# EAGLE board BusPirate-LCD.v0a (EAGLE 8.4.3)
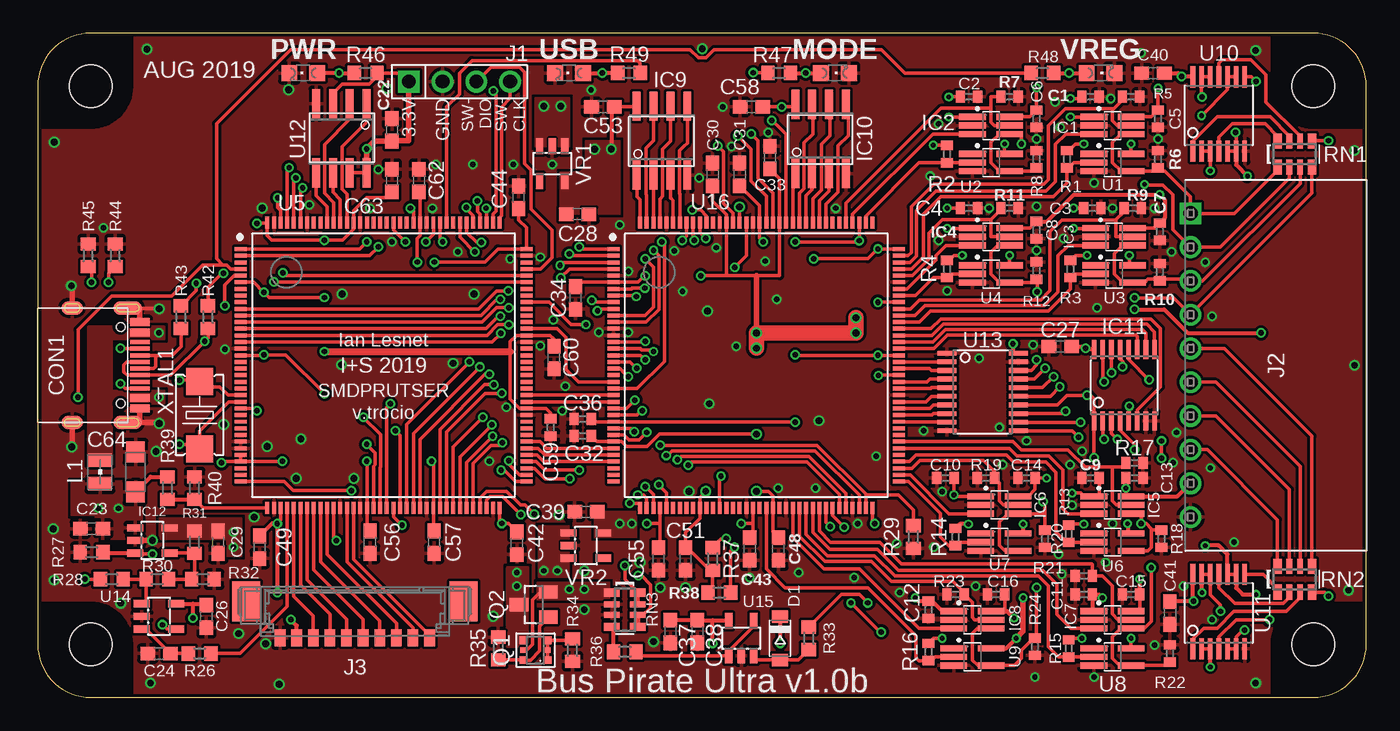
[diagram p2: board, top side]
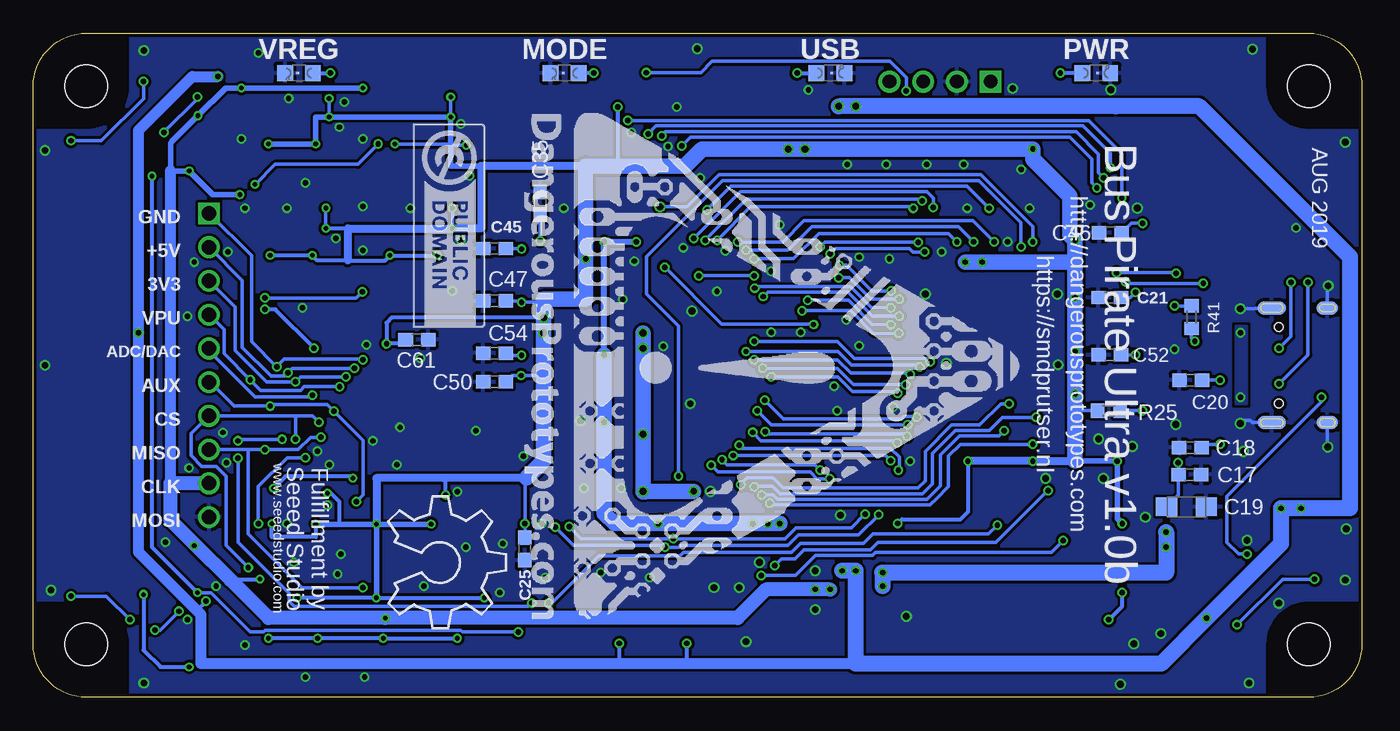
[diagram p3: board, bottom side, seen from below]

Size 100 x 50 mm. Coordinates in mm from the lower left corner, seen from the top.
Copper layers (1*16): Top 0.035mm / dielectric 1.5mm / Bottom 0.035mm
Design rules "dirt_cheap_dirty_boards.v1.1": minimum track width 6mil, minimum drill 12mil, track to track 6mil, track to pad 6mil, pad to pad 6mil, via to via 6mil, smd to smd 0mil, copper to edge 10mil, drill to drill 10mil, minimum pad ring 10mil, minimum via ring 6mil, stop-mask expansion 2mil, vias tented up to drill 25mil, thermal gap 10mil

## Footprints (pad centres in the part's own frame; a part is rotated, then mirrored left to right if it is on the bottom)
C0402 = smd 0.7 x 0.9: 1 -0.65,0; 2 0.65,0
C0603 = smd 1.1 x 1: 1 -0.85,0; 2 0.85,0
SMC_A = smd 1.6 x 1.4: + -1.5,0; - 1.5,0
C603 = smd 1.1 x 1: 1 -0.85,0; 2 0.85,0
C402 = smd 0.7 x 0.9: 1 -0.65,0; 2 0.65,0
C-31-M-12 = smd 0.3 x 1.45: CC1 -1.25,3.005; CC2 1.75,3.005; DN1 0.25,3.005; DN2 -0.75,3.005; DP1 -0.25,3.005; DP2 0.75,3.005; SBU1 1.25,3.005; SBU2 -1.75,3.005 | smd 0.6 x 1.45: GND@1 -3.25,3.005; GND@2 3.25,3.005; VBUS@1 -2.45,3.005; VBUS@2 2.45,3.005 | smd 1 x 2.1: P$1 4.32,2.09; P$2 -4.32,2.09 | smd 1 x 1.6: P$3 -4.32,-2.09; P$4 4.32,-2.09 | smd 1 x 2.1 bottom: P$5 -4.32,2.09; P$8 4.32,2.09 | smd 1 x 1.6 bottom: P$6 -4.32,-2.09; P$7 4.32,-2.09 | hole 0.65: 2.89,1.56; -2.89,1.56
SOD-123 = smd 0.91 x 1.22: A 1.635,0; C -1.635,0
SC-70-6_EXTENDED_PADS = smd 0.47 x 2: 1 -0.65,-1.4; 2 0,-1.4; 3 0.65,-1.4; 4 0.65,1.4; 5 0,1.4; 6 -0.65,1.4
SOIC-8 = smd 0.6 x 2.2: 1 -1.905,-2.6; 2 -0.635,-2.6; 3 0.635,-2.6; 4 1.905,-2.6; 5 1.905,2.6; 6 0.635,2.6; 7 -0.635,2.6; 8 -1.905,2.6
TSSOP-16 = smd 0.35 x 1.43: 1 -2.275,-2.7; 2 -1.625,-2.7; 3 -0.975,-2.7; 4 -0.325,-2.7; 5 0.325,-2.7; 6 0.975,-2.7; 7 1.625,-2.7; 8 2.275,-2.7; 9 2.275,2.7; 10 1.625,2.7; 11 0.975,2.7; 12 0.325,2.7; 13 -0.325,2.7; 14 -0.975,2.7; 15 -1.625,2.7; 16 -2.275,2.7
SOT-23-5 = smd 0.55 x 1.2: 1 -0.95,-1.3; 2 0,-1.3; 3 0.95,-1.3; 4 0.95,1.3; 5 -0.95,1.3
M1X4 = drill 1.02 pad 1.632 square: 1 0,0 | drill 1.02 pad 1.632: 2 2.54,0; 3 5.08,0; 4 7.62,0
M1X10_MALE_RIGHT_ANGLES_PTH_SHROUDED = drill 1.09 square: 1 -11.43,-6.415 | drill 1.09: 2 -8.89,-6.415; 3 -6.35,-6.415; 4 -3.81,-6.415; 5 -1.27,-6.415; 6 1.27,-6.415; 7 3.81,-6.415; 8 6.35,-6.415; 9 8.89,-6.415; 10 11.43,-6.415
MOLEX_533980771 = smd 2.1 x 3: B1 -8.175,1.513; B2 8.175,1.513 | smd 0.8 x 1.3: P1 5.625,-1.238; P2 4.375,-1.238; P3 3.125,-1.238; P4 1.875,-1.238; P5 0.625,-1.238; P6 -0.625,-1.238; P7 -1.875,-1.238; P8 -3.125,-1.238; P9 -4.375,-1.238; P10 -5.625,-1.238
WE-KI_0805_B = smd 1.02 x 1.78: 1 -0.89,0; 2 0.89,0
LED-805 = smd 1.2 x 1.2: A 0,-1.05; C 0,1.05
DP10050_V1 = hole 3.2: 4,4; 96,4; 96,46; 4,46
SOT-363 = smd 0.6 x 0.6: 1 -0.75,-0.9; 3 0.75,-0.9; 4 0.75,0.9; 6 -0.75,0.9 | smd 0.4 x 0.5: 2 0,-0.9; 5 0,0.9
SOT-23 = smd 1 x 1.4: 1 -0.95,-1.1; 2 0.95,-1.1; 3 0,1.1
R0402 = smd 0.7 x 0.9: 1 -0.65,0; 2 0.65,0
R603 = smd 1 x 1.1: 1 -0.85,0; 2 0.85,0
R0603 = smd 1 x 1.1: 1 -0.85,0; 2 0.85,0
RN8P-4R-CRA06S = smd 0.63 x 1.15: 1 -1.295,-0.975; 4 1.295,-0.975; 5 1.295,0.975; 8 -1.295,0.975 | smd 0.44 x 1.15: 2 -0.4,-0.975; 3 0.4,-0.975; 6 0.4,0.975; 7 -0.4,0.975
SC-70-5_EXTENDED_PADS = smd 0.47 x 2: 1 -0.65,-1.4; 2 0,-1.4; 3 0.65,-1.4; 4 0.65,1.4; 5 -0.65,1.4
TQFP-144 = smd 0.9 x 0.3: 1 -10.75,8.75; 2 -10.75,8.25; 3 -10.75,7.75; 4 -10.75,7.25; 5 -10.75,6.75; 6 -10.75,6.25; 7 -10.75,5.75; 8 -10.75,5.25; 9 -10.75,4.75; 10 -10.75,4.25; 11 -10.75,3.75; 12 -10.75,3.25; 13 -10.75,2.75; 14 -10.75,2.25; 15 -10.75,1.75; 16 -10.75,1.25; 17 -10.75,0.75; 18 -10.75,0.25; 19 -10.75,-0.25; 20 -10.75,-0.75; 21 -10.75,-1.25; 22 -10.75,-1.75; 23 -10.75,-2.25; 24 -10.75,-2.75; 25 -10.75,-3.25; 26 -10.75,-3.75; 27 -10.75,-4.25; 28 -10.75,-4.75; 29 -10.75,-5.25; 30 -10.75,-5.75; 31 -10.75,-6.25; 32 -10.75,-6.75; 33 -10.75,-7.25; 34 -10.75,-7.75; 35 -10.75,-8.25; 36 -10.75,-8.75; 73 10.75,-8.75; 74 10.75,-8.25; 75 10.75,-7.75; 76 10.75,-7.25; 77 10.75,-6.75; 78 10.75,-6.25; 79 10.75,-5.75; 80 10.75,-5.25; 81 10.75,-4.75; 82 10.75,-4.25; 83 10.75,-3.75; 84 10.75,-3.25; 85 10.75,-2.75; 86 10.75,-2.25; 87 10.75,-1.75; 88 10.75,-1.25; 89 10.75,-0.75; 90 10.75,-0.25; 91 10.75,0.25; 92 10.75,0.75; 93 10.75,1.25; 94 10.75,1.75; 95 10.75,2.25; 96 10.75,2.75; 97 10.75,3.25; 98 10.75,3.75; 99 10.75,4.25; 100 10.75,4.75; 101 10.75,5.25; 102 10.75,5.75; 103 10.75,6.25; 104 10.75,6.75; 105 10.75,7.25; 106 10.75,7.75; 107 10.75,8.25; 108 10.75,8.75 | smd 0.3 x 0.9: 37 -8.75,-10.75; 38 -8.25,-10.75; 39 -7.75,-10.75; 40 -7.25,-10.75; 41 -6.75,-10.75; 42 -6.25,-10.75; 43 -5.75,-10.75; 44 -5.25,-10.75; 45 -4.75,-10.75; 46 -4.25,-10.75; 47 -3.75,-10.75; 48 -3.25,-10.75; 49 -2.75,-10.75; 50 -2.25,-10.75; 51 -1.75,-10.75; 52 -1.25,-10.75; 53 -0.75,-10.75; 54 -0.25,-10.75; 55 0.25,-10.75; 56 0.75,-10.75; 57 1.25,-10.75; 58 1.75,-10.75; 59 2.25,-10.75; 60 2.75,-10.75; 61 3.25,-10.75; 62 3.75,-10.75; 63 4.25,-10.75; 64 4.75,-10.75; 65 5.25,-10.75; 66 5.75,-10.75; 67 6.25,-10.75; 68 6.75,-10.75; 69 7.25,-10.75; 70 7.75,-10.75; 71 8.25,-10.75; 72 8.75,-10.75; 109 8.75,10.75; 110 8.25,10.75; 111 7.75,10.75; 112 7.25,10.75; 113 6.75,10.75; 114 6.25,10.75; 115 5.75,10.75; 116 5.25,10.75; 117 4.75,10.75; 118 4.25,10.75; 119 3.75,10.75; 120 3.25,10.75; 121 2.75,10.75; 122 2.25,10.75; 123 1.75,10.75; 124 1.25,10.75; 125 0.75,10.75; 126 0.25,10.75; 127 -0.25,10.75; 128 -0.75,10.75; 129 -1.25,10.75; 130 -1.75,10.75; 131 -2.25,10.75; 132 -2.75,10.75; 133 -3.25,10.75; 134 -3.75,10.75; 135 -4.25,10.75; 136 -4.75,10.75; 137 -5.25,10.75; 138 -5.75,10.75; 139 -6.25,10.75; 140 -6.75,10.75; 141 -7.25,10.75; 142 -7.75,10.75; 143 -8.25,10.75; 144 -8.75,10.75
TSSOP-14 = smd 0.35 x 1.6: 1 -1.95,-2.7; 2 -1.3,-2.7; 3 -0.65,-2.7; 4 0,-2.7; 5 0.65,-2.7; 6 1.3,-2.7; 7 1.95,-2.7; 8 1.95,2.9; 9 1.3,2.9; 10 0.65,2.9; 11 0,2.9; 12 -0.65,2.9; 13 -1.3,2.9; 14 -1.95,2.9
TSSOP-20 = smd 0.35 x 1.43: 1 -2.925,-2.7; 2 -2.275,-2.7; 3 -1.625,-2.7; 4 -0.975,-2.7; 5 -0.325,-2.7; 6 0.325,-2.7; 7 0.975,-2.7; 8 1.625,-2.7; 9 2.275,-2.7; 10 2.925,-2.7; 11 2.925,2.7; 12 2.275,2.7; 13 1.625,2.7; 14 0.975,2.7; 15 0.325,2.7; 16 -0.325,2.7; 17 -0.975,2.7; 18 -1.625,2.7; 19 -2.275,2.7; 20 -2.925,2.7
SOT-23-5@1 = smd 0.55 x 1.2: 1 -0.95,-1.3; 2 0,-1.3; 3 0.95,-1.3; 4 0.95,1.3; 5 -0.95,1.3
XTAL_4X6 = smd 2.032 x 2.032: 1 -2.54,0; 2 2.54,0

## Placement (x,y rotation side)
C1  0.1uF  [C0402]  79.25,45.21 0 top
C2  0.1uF  [C0402]  70.1,45.21 0 top
C3  0.1uF  [C0402]  79.38,36.83 0 top
C4  0.1uF  [C0402]  70.1,36.83 0 top
C5  0.1uF  [C0402]  84.33,43.56 90 top
C6  0.1uF  [C0402]  75.18,43.56 90 top
C7  0.1uF  [C0402]  84.45,35.05 90 top
C8  0.1uF  [C0402]  75.18,35.18 90 top
C9  0.1uF  [C0402]  79.25,16.51 180 top
C10  0.1uF  [C0402]  68.33,16.51 180 top
C11  0.1uF  [C0402]  78.74,7.75 180 top
C12  0.1uF  [C0402]  67.06,6.6 270 top
C13  0.1uF  [C0402]  82.55,16.51 180 top
C14  0.1uF  [C0402]  74.42,16.51 0 top
C15  0.1uF  [C0402]  82.3,7.75 0 top
C16  0.1uF  [C0402]  72.14,7.75 0 top
C17  0.1uF  [C0603]  12.95,16.76 180 bottom
C18  22pF  [C0603]  12.91,18.8 0 bottom
C19  1uF  [SMC_A]  13.21,14.35 0 bottom
C20  22pF  [C0603]  12.88,23.88 0 bottom
C21  0.1uF  [C0603]  18.97,30.1 0 bottom
C22  0.1uF  [C0603]  26.67,42.72 270 top
C23  10uF  [C603]  4.06,12.7 180 top
C24  [C0603]  9.14,3.3 180 top
C25  0.1uF  [C0603]  62.99,11.18 90 bottom
C26  0.1uF  [C0603]  12.7,6.1 270 top
C27  0.1uF  [C0603]  76.96,26.42 180 top
C28  1uf  [C0603]  40.64,36.37 0 top
C29  1uF  [C603]  13.59,11.68 270 top
C30  0.1uF  [C0603]  50.8,39.37 270 top
C31  0.1uF  [C0603]  52.83,39.37 270 top
C32  0.1uF  [C402]  41.02,19.68 180 top
C33  0.1uF  [C0603]  55.12,40.64 270 top
C34  0.1uF  [C0603]  40.49,30.07 90 top
C35  0.1uF  [C0603]  61.85,37.21 270 bottom
C36  0.1uF  [C402]  41.02,20.95 180 top
C37  0.1uF  [C0603]  47.62,4.95 270 top
C38  1uF  [C0603]  49.66,4.95 270 top
C39  1uf  [C0603]  41.27,13.97 180 top
C40  0.1uF  [C0603]  83.95,46.99 180 top
C41  0.1uF  [C0603]  85.22,6.35 270 top
C42  0.1uF  [C0603]  36.07,11.61 90 top
C43  0.1uF  [C0603]  53.59,11.18 90 top
C44  0.1uF  [C0603]  36.2,37.64 270 top
C45  0.1uF  [C0603]  65.28,33.78 0 bottom
C46  0.1uF  [C0603]  18.92,34.97 0 bottom
C47  0.1uF  [C0603]  65.28,29.84 0 bottom
C48  0.1uF  [C0603]  55.75,11.18 90 top
C49  0.1uF  [C0603]  16.72,11.3 90 top
C50  0.1uF  [C0603]  65.28,23.75 0 bottom
C51  0.1uF  [C0603]  48.77,10.41 90 top
C52  0.1uF  [C0603]  18.97,25.78 0 bottom
C53  0.1uF  [C0603]  42.55,44.45 180 top
C54  0.1uF  [C0603]  65.28,25.91 0 bottom
C55  0.1uF  [C0603]  46.74,10.41 90 top
C56  0.1uF  [C0603]  25.02,11.68 90 top
C57  0.1uF  [C0603]  29.84,11.68 90 top
C58  0.1uF  [C0603]  53.72,44.45 180 top
C59  0.1uF  [C402]  38.61,20.32 270 top
C60  0.1uF  [C0603]  38.86,25.57 90 top
C61  0.1uF  [C0603]  71.12,26.92 0 bottom
C62  0.1uF  [C0603]  28.7,38.91 270 top
C63  0.1uF  [C0603]  26.67,38.91 270 top
C64  10uF  [SMC_A]  7.37,16.97 90 top
CON1  USB-C-12  [C-31-M-12]  4.69,25 270 top
D1  [SOD-123]  55.88,4.45 270 top
IC1  SN74LVC1T45DBV  [SC-70-6_EXTENDED_PADS]  80.9,43.05 270 top
IC2  SN74LVC1T45DBV  [SC-70-6_EXTENDED_PADS]  71.75,43.05 270 top
IC3  SN74LVC1T45DBV  [SC-70-6_EXTENDED_PADS]  81.03,34.67 270 top
IC4  SN74LVC1T45DBV  [SC-70-6_EXTENDED_PADS]  71.75,34.67 270 top
IC5  SN74LVC1T45DBV  [SC-70-6_EXTENDED_PADS]  80.9,14.48 270 top
IC6  SN74LVC1T45DBV  [SC-70-6_EXTENDED_PADS]  72.39,14.48 270 top
IC7  SN74LVC1T45DBV  [SC-70-6_EXTENDED_PADS]  80.9,5.84 270 top
IC8  SN74LVC1T45DBV  [SC-70-6_EXTENDED_PADS]  70.36,5.84 270 top
IC9  23LC1024  [SOIC-8]  46.99,41.91 0 top
IC10  23LC1024  [SOIC-8]  58.93,42.04 0 top
IC11  74HCT4051  [TSSOP-16]  81.79,23.5 0 top
IC12  MCP1824_ADJ  [SOT-23-5]  8.64,11.81 270 top
J1  CON_HEADER_1X04  [M1X4]  27.94,46.35 0 top
J2  CON_HEADER_1X10-RIGHT_ANGLED_PTH_SHROUDED  [M1X10_MALE_RIGHT_ANGLES_PTH_SHROUDED]  93.19,25 270 top
J3  CON_MOLEX_MALE_SMT_SH_1.25  [MOLEX_533980771]  23.88,5.71 0 top
L1  1.5A  [WE-KI_0805_B]  4.7,16.97 90 top
LED1  Optional YELLOW  [LED-805]  20,47 270 bottom
LED2  YELLOW  [LED-805]  20,47 90 top
LED3  YELLOW  [LED-805]  60,47 270 top
LED4  Optional YELLOW  [LED-805]  60,47 90 bottom
LED5  YELLOW  [LED-805]  80,47 270 top
LED6  Optional YELLOW  [LED-805]  80,47 90 bottom
LED7  YELLOW  [LED-805]  40,47 90 top
LED8  Optional YELLOW  [LED-805]  40,47 270 bottom
LOGO1  LOGO_CC-0  [LOGO_CC-0]  71.37,43.18 270 bottom
PCB1  PCB_DP_RECTANGLE-50X100  [DP10050_V1]  0,0 0 top
Q1  DMMT3906W  [SOT-363]  37.47,3.56 90 top
Q2  [SOT-23]  37.34,6.99 90 top
R1  100K  [R0402]  77.47,40.51 90 top
R2  100K  [R0402]  68.45,40.89 90 top
R3  100K  [R0402]  77.72,32.26 90 top
R4  100K  [R0402]  68.45,32.26 90 top
R5  100K  [R0402]  82.3,45.21 180 top
R6  1M  [R0402]  84.33,40.51 270 top
R7  100K  [R0402]  73.15,45.21 180 top
R8  1M  [R0402]  75.18,40.51 270 top
R9  100K  [R0402]  82.42,36.83 180 top
R10  1M  [R0402]  84.45,32 270 top
R11  100K  [R0402]  73.15,36.83 180 top
R12  1M  [R0402]  75.18,32.13 270 top
R13  100K  [R0402]  77.6,12.32 90 top
R14  100K  [R0402]  69.09,12.06 90 top
R15  100K  [R0402]  77.6,3.68 90 top
R16  100K  [R0402]  67.06,3.41 90 top
R17  100K  [R0402]  82.55,17.65 180 top
R18  1M  [R0402]  84.58,11.94 90 top
R19  100K  [R0402]  71.37,16.51 0 top
R20  1M  [R0402]  75.82,11.94 90 top
R21  100K  [R0402]  78.74,9.14 0 top
R22  1M  [R0402]  85.22,3.3 270 top
R23  100K  [R0402]  69.09,7.75 0 top
R24  1M  [R0402]  75.06,3.81 90 top
R25  10K  [R603]  19.05,21.59 180 bottom
R26  [R0603]  12.19,3.3 180 top
R27  10K  [R603]  4.06,10.92 180 top
R28  0R  [R603]  5.59,8.89 0 top
R29  10K  [R0603]  65.91,12.06 90 top
R30  78.7K  [R603]  9.02,8.89 0 top
R31  100K  [R603]  11.81,11.68 90 top
R32  50K  [R603]  12.45,8.89 0 top
R33  [R0603]  58.04,4.45 270 top
R34  [R603]  40.26,3.56 90 top
R35  [R603]  34.67,3.68 270 top
R36  [R0603]  44.2,3.43 180 top
R37  10K  [R0603]  50.8,10.41 270 top
R38  10K  [R0603]  51.31,7.87 180 top
R39  10K  [R0603]  9.78,15.75 270 top
R40  10K  [R0603]  11.81,15.75 270 top
R41  1.5K  [R0603]  12.83,28.62 90 bottom
R42  22R  [R0603]  12.83,28.62 270 top
R43  22R  [R0603]  10.79,28.62 270 top
R44  5K1  [R0603]  5.84,33.27 90 top
R45  5K1  [R0603]  3.81,33.27 90 top
R46  1K1  [R603]  24.7,47 0 top
R47  1K1  [R603]  55.81,47 180 top
R48  1K1  [R603]  75.62,47 180 top
R49  1K1  [R603]  44.51,47 0 top
RN1  2K  [RN8P-4R-CRA06S]  94.61,40.89 0 top
RN2  2K  [RN8P-4R-CRA06S]  94.61,8.89 0 top
RN3  10K  [RN8P-4R-CRA06S]  44.2,6.6 270 top
U1  74LVC1G07DBV  [SC-70-5_EXTENDED_PADS]  80.9,40.26 270 top
U2  74LVC1G07DBV  [SC-70-5_EXTENDED_PADS]  71.75,40.26 270 top
U3  74LVC1G07DBV  [SC-70-5_EXTENDED_PADS]  81.03,31.88 270 top
U4  74LVC1G07DBV  [SC-70-5_EXTENDED_PADS]  71.75,31.88 270 top
U5  STM32F103ZX  [TQFP-144]  26.04,25 0 top
U6  74LVC1G07DBV  [SC-70-5_EXTENDED_PADS]  80.9,11.68 270 top
U7  74LVC1G07DBV  [SC-70-5_EXTENDED_PADS]  72.39,11.68 270 top
U8  74LVC1G07DBV  [SC-70-5_EXTENDED_PADS]  80.9,3.05 270 top
U9  74LVC1G07DBV  [SC-70-5_EXTENDED_PADS]  70.36,3.05 270 top
U10  74HCT4066PW  [TSSOP-14]  88.9,43.81 0 top
U11  74HCT4066PW  [TSSOP-14]  88.9,6.35 0 top
U12  W25X40CL  [SOIC-8]  22.86,42.09 180 top
U13  74LVC245A  [TSSOP-20]  71.12,22.99 270 top
U14  MCP6001  [SOT-23-5]  9.14,6.1 270 top
U15  MCP6001  [SOT-23-5]  52.96,4.45 0 top
U16  ICE40HX4K  [TQFP-144]  54.09,25 0 top
U$1  [DP-LOGO]  61.84,-11.22 0 top  (outside the outline)
U$2  [OSHW_8X350_NOTEXT]  73.28,15.11 270 bottom
U$4  [DP_LOGO_ART_1.5X1.5]  63.01,43.98 270 bottom
VR1  MCP1801T-3302I/OT  [SOT-23-5@1]  38.73,40.18 180 top
VR2  MCP1801T-1202I/OT  [SOT-23-5@1]  41.27,11.43 270 top
XTAL1  8Mhz  [XTAL_4X6]  12.19,21.26 90 top

## Tracks (layer width: path | path; a pad name or v marks a point on that pad's centre or on a via)
1V2  (via drill 0.41)
  Top 0.254: C55.2 46.84,11.37 U16.40 46.84,13.08 v45.85,13.08 | 53.84,13.08 53.84,12.27 C43.2 | C31.2 54.34,37.01 U16.126 54.34,34.56 v54.61,34.29 | C36.1 41.67,20.75 U16.27 45.26,20.75 56.97,20.75 v57.02,20.7 | 53.84,13.08 v52.96,13.08 | U16.54 53.84,13.08 | v57.02,25.78 57.05,25.75 v63.25,25.75 U16.92 | v57.02,34.29 61.75,34.29 v61.85,34.38 61.84,34.4 U16.111
  Bottom 0.254: C35.2 v61.85,34.38 | C54.2 64.27,25.75 v63.25,25.75
  Bottom 0.457: v57.02,25.78 v57.02,34.29 v54.61,34.29
  Bottom 1.168: v43.81,13.08 v45.85,13.08 46.86,13.08 48.26,13.08 v52.96,13.08 56.26,13.08 57.02,13.84 57.02,17.27 v57.02,20.7 v57.02,25.78
  other vias: 44.7,13.08
  pour Top (no thermals): 45.09,13.97 41.91,13.97 41.91,12.06 45.09,12.06
3V3  (via drill 0.35, 0.41, 0.51)
  Top 0.254: C62.2 28.79,37.98 U5.121 28.79,34.76 28.57,34.55 v28.57,32.77 | C60.2 38.86,26.97 38.58,27.25 U5.95 36.04,27.25 35.56,26.77 35.56,26.04 35.56,22.48 36.29,21.75 U5.84 38.25,21.75 38.61,21.39 C59.1 | C63.2 26.25,37.64 24.77,37.64 23.79,36.66 U5.131 23.79,35.26 22.95,34.42 v21.59,34.42 17.61,34.42 17.29,34.75 17.29,35.69 | C56.2 24.79,12.56 U5.52 24.79,17.76 v24.77,17.78 | C32.1 42.11,19.25 U16.30 43.96,19.25 44.34,18.88 45.88,18.88 46.81,19.81 v54.1,19.81 | J1.1 27.3,47 R46.2 25.55,46.75 24.97,46.17 22.93,46.17 22.23,45.47 U12.3 | v50.29,15.51 49.84,15.06 U16.46 49.84,13.48 48.77,12.41 C51.2 48.9,11.26 50.59,9.56 R37.2 50.8,7.87 R38.2 | U5.33 18.39,17.75 v18.41,17.78 | U5.32 U5.33 | v29.65,17.78 29.79,17.64 U5.62 29.79,12.53 C57.2 | v29.84,32.77 33.66,32.77 34.65,33.75 U5.108 36.78,35.35 36.2,35.94 C44.2 | U5.144 17.29,35.69 | U5.6 16.27,31.25 v17.03,30.49 17.42,30.1 v21.59,30.1 | v45.72,31.75 45.69,31.75 45.19,31.25 U16.6 40.81,31.25 C34.2 | U16.100 v63.25,29.75 | v54.1,15.49 54.99,15.49 55.34,15.15 U16.57 55.34,12.44 C48.2 | 51.84,31.75 U16.131 51.84,36.34 50.8,37.38 C30.2 | 51.84,31.75 54.1,31.75 55.84,31.75 U16.123 55.84,39.07 C33.2 | U12.7 U12.8 | v18.03,13.08 18.03,13.11 18.29,13.36 U5.39 | v49.91,31.75 51.84,31.75 | v63.28,24.23 63.55,24.23 63.57,24.25 U16.89 | U5.17 16.99,25.75 v17.02,25.78 18.67,25.78 v21.59,22.86 | v16.51,35.69 17.29,35.69 | U5.33 13.94,17.75 v13.84,17.65 | U5.72 34.78,13.32 34.94,13.17 v34.94,13.09 35.43,13.09 C42.2 | v68.07,4.45 67.44,4.45 R16.2 | v82.3,4.45 v82.3,4.44 U8.5 | IC6.1 69.07,15.13 v68.96,15.24 68.98,15.26 C10.1 | v78.59,4.45 77.6,4.45 R15.2
  Top 0.254: 77.6,13.05 R13.2 77.6,13.05 | IC5.1 78.75,15.13 78.5,15.38 v77.87,15.38 | IC2.1 70.34,43.69 v68.58,43.69 | v73.15,33.27 U4.5 | v82.17,33.27 82.17,32.53 U3.5 | v78.99,33.27 78.09,33.27 R3.2 | v69.6,33.27 68.95,33.27 68.58,32.91 R4.2 | v77.98,35.31 79.61,35.31 IC3.1 | C3.1 v77.98,36.83 | v68.45,35.31 70.34,35.31 IC4.1 | C4.1 v68.45,36.83 | v67.4,41.57 68.43,41.57 R2.2 | C2.1 v68.58,45.21 | U2.5 72.77,40.91 v72.77,41.66 | v82.3,41.66 U1.5 | IC1.1 79.5,43.69 v77.72,43.69 | C1.1 78.6,45.09 v77.72,45.09 | U16.72 62.84,13.23 v62.99,13.08 | R1.2 77.61,41.16 78.11,41.66 v78.74,41.66 | U16.108 v63.25,33.75 63.21,33.75 62.48,33.02 v58.42,33.02 | IC5.1 | C9.1 79.9,15.13 IC5.1 | C58.1 v56.01,44.45 57.02,44.45 IC10.8 | C53.1 45.02,44.45 | v78.74,13.05 77.6,13.05
  Top 0.305: 45.02,44.45 IC9.8 | C53.1 43.18,44.23 v43.18,41.27 | v73.41,26.63 73.41,25.95 73.44,25.91 U13.20 | U9.5 72.91,3.7 v73.66,4.45 | v66.04,7.49 66.28,7.25 C12.1 67.32,7.25 68.08,6.49 IC8.1 | v80.14,7.49 79.88,7.75 C11.1 79.39,6.6 IC7.1 | v70.06,13.05 69.42,13.05 R14.2 | v74.17,13.03 74.17,12.33 U7.5 | v82.04,13.08 82.04,12.33 U6.5 | J3.P9 19.5,5.39 v19.05,5.84 | v18.03,7.87 18.03,12.49 v18.03,13.08 | C49.2 17.67,13.11 18.03,13.11
  Top 0.406: J1.1 27.94,41.91 26.71,41.91 C22.2 25.36,41.87 v24.77,41.27 U12.8 | v54.1,27.43 54.1,31.75 | v73.66,4.45 74.17,4.95 v74.17,7.49
  Top 0.508: v21.59,26.04 35.56,26.04
  Top 1.168: v54.1,26.29 v54.1,27.43 v61.59,27.43 v61.59,28.57
  Bottom 0.254: v45.72,31.75 v49.91,31.75 | C50.2 63.95,24.23 v63.28,24.23 61.7,24.23 61.59,24.13 | C47.2 63.34,29.84 v63.25,29.75 61.59,29.75 61.59,29.97 | C45.2 63.28,33.78 v63.25,33.75 | C52.2 v17.02,25.78 | C21.2 17.42,30.1 v17.03,30.49 | C46.2 17.36,35.69 v16.51,35.69 | v13.84,17.65 13.8,17.61 C17.2 13.8,15.26 C19.+ | v77.98,36.83 v77.98,35.31 | v68.45,36.83 v68.45,35.31 | 68.58,41.4 68.42,41.57 v67.4,41.57 | v68.58,45.21 v68.58,43.69 | v77.72,45.09 v77.72,43.69 | v72.77,41.66 68.58,41.66 | C25.2 v62.99,13.08 62.99,16.38 62.87,16.51 | R25.2 21.59,21.59
  Bottom 0.305: v56.01,44.45 56.01,41.02 56.01,40.01 | v29.65,17.78 29.65,13.97 30.21,13.41 34.62,13.41 v34.94,13.09 | C61.1 72.26,26.63 v73.41,26.63 73.41,28.19 73.03,28.57 v61.59,28.57 | v68.07,4.45 v73.66,4.45 v78.59,4.45 v82.3,4.45 | v66.04,7.49 v74.17,7.49 v80.14,7.49 | v68.96,15.24 68.96,16.51 69.09,16.51 | 70.06,13.03 v70.06,13.05 | v82.17,33.27 v78.99,33.27 78.61,32.89 76.33,32.89 73.53,32.89 v73.15,33.27 v69.6,33.27 | 76.33,35.31 v77.98,35.31 | v19.05,5.84 18.03,6.86 v18.03,7.87 | v77.87,15.38 77.61,15.38 76.96,14.73 76.96,13.03 | v82.04,13.08 82.04,12.06 78.74,12.06 v78.74,13.05
  Bottom 0.406: v18.03,13.08 18.41,13.46 v18.41,17.78 21.34,17.78 21.59,17.78 | v74.17,13.03 v74.17,7.49 | v74.17,13.03 70.06,13.03 | v74.17,13.03 76.96,13.03 78.74,13.03 v78.74,13.05 | 66.29,40.01 68.58,40.01 68.58,41.4 68.58,41.66 v68.58,43.69 v77.72,43.69 78.74,43.69 v78.74,41.66 v82.3,41.66
  Bottom 0.61: v29.65,17.78 v24.77,17.78 21.34,17.78 | 62.87,16.51 69.09,16.51 74.17,16.51 v74.17,13.03 | 58.42,40.01 66.29,40.01 66.29,35.31 v68.45,35.31 76.33,35.31 76.33,32.89
  Bottom 1.168: 21.59,32.77 v21.59,34.42 21.97,34.8 21.97,37.72 24.77,40.51 v24.77,41.27 v41.91,41.27 49.66,41.27 50.93,40.01 56.01,40.01 58.42,40.01 v58.42,33.02 58.42,29.97 61.59,29.97 v61.59,28.57 61.59,24.13 61.59,17.78 62.87,16.51 | 21.59,32.77 v21.59,30.1 v21.59,26.04 v21.59,22.86 21.59,21.59 21.59,17.78 | 21.59,32.77 v28.57,32.77 v29.84,32.77 | v50.29,15.51 50.29,15.49 53.98,15.49 | v54.1,27.43 v54.1,19.81 v54.1,15.49
  Bottom 1.219: v54.1,15.49 53.98,15.49
  pour Top (no thermals): 39.37,39.55 40.81,39.55 41.27,40.01 41.27,41.91 43.81,41.91 43.81,36.37 39.37,36.37
ADC1  (via drill 0.41)
  Top 0.254: U5.47 22.29,12.01 v22.48,11.81 | v45.21,9.17 45.44,9.17 46.12,8.49 46.12,7.77 46.12,6.75 45.57,6.2 RN3.6
  Top 0.305: RN3.6 RN3.5
  Bottom 0.254: v22.48,11.81 23.37,10.92 36.6,10.92 36.83,10.69 41.13,10.69 42.65,9.17 v45.21,9.17
ADC_MUX_EN
  Top 0.254: IC11.6 82.76,21.63 84.52,23.38 84.52,27.76 83.78,28.5 67.99,28.5 67.25,27.75 U16.96
ADC_MUX_S0
  Top 0.254: IC11.11 82.76,27.18 82.67,27.27 68.49,27.27 67.47,26.25 U16.93
ADC_MUX_S1
  Top 0.254: U16.94 67.4,26.75 68.33,27.68 83.16,27.68 83.41,27.43 IC11.10
ADC_MUX_S2
  Top 0.254: IC11.9 84.06,27.51 83.48,28.09 68.16,28.09 67.32,27.25 U16.95
BPIO0  (via drill 0.41)
  Top 0.254: U13.18 74.78,24.61 75.18,25.02 v75.18,25.4 | 84.07,39.61 U1.4 81.55,39.61 80.9,40.26 80.9,41.78 81.53,42.42 81.55,42.4 IC1.4 | 84.07,39.61 R6.2 | 84.07,39.61 84.85,39.61 86.77,37.69 J2.1 90.08,36.43 93.32,39.66 RN1.1 | v81.67,24.88 81.67,25.27 81.46,25.48 IC11.13
  Bottom 0.254: v75.18,25.4 75.25,25.46 81.11,25.46 81.67,24.9 v81.67,24.88 83.57,26.78 83.57,33.25 86.74,36.43 J2.1
BPIO1  (via drill 0.35, 0.41)
  Top 0.254: RN1.2 94.22,39.1 89.01,33.89 J2.2 85.44,35.22 85.44,37.85 84.71,38.58 83.34,38.58 v83.31,38.61 | U13.17 75.02,23.96 v75.82,24.77 | v80.83,24.45 80.81,24.47 IC11.14 | R8.2 74.93,39.61 U2.4 72.41,39.61 71.75,40.26 71.75,41.78 72.38,42.4 IC2.4 73.93,42.4 74.04,42.29 v74.04,41.66
  Bottom 0.254: v75.82,24.77 80.52,24.77 v80.83,24.45 81.09,24.19 82.11,24.19 84.26,26.35 84.26,31.38 J2.2 | v74.04,41.66 75.56,40.13 81.79,40.13 v83.31,38.61
BPIO2  (via drill 0.41)
  Top 0.254: RN1.3 95.02,38.69 87.67,31.35 J2.3 86.75,31.35 86.61,31.48 84.84,31.48 | U13.16 75.64,23.31 v76.45,24.13 | IC11.15 80.16,23.85 v80.26,23.75 | IC3.4 81.65,34.02 81.03,33.4 81.03,31.88 81.68,31.23 U3.4 83.31,31.23 83.57,31.48 84.84,31.48 | 84.84,31.48 84.58,31.48 R10.2
  Bottom 0.254: J2.3 84.8,29.38 84.8,26.12 82.42,23.75 v80.26,23.75 79.88,24.13 v76.45,24.13
BPIO3  (via drill 0.41)
  Top 0.254: RN1.4 95.91,37.95 J2.4 85.51,30.07 v82.55,30.07 | IC4.4 72.25,34.02 71.75,33.53 71.75,31.88 72.41,31.23 U4.4 75.23,31.23 | U13.15 76.21,22.66 v76.94,23.39 | IC11.12 82.11,25.43 83.65,23.9 v83.67,23.9 | v75.23,30.54 75.23,31.23 | R12.2 75.23,31.48 75.23,31.24 75.23,31.23
  Bottom 0.254: v76.94,23.39 79.6,23.39 79.87,23.11 82.88,23.11 v83.67,23.9 85.64,25.87 85.64,27.68 J2.4 | v75.23,30.54 75.69,30.07 v82.55,30.07
BPIO4  (via drill 0.41)
  Top 0.254: RN2.5 95.91,19.66 89.3,26.27 J2.5 | U13.14 76.75,22.01 77.47,22.73 v78.99,22.73 79.27,22.73 79.51,22.49 IC11.1 79.51,19.83 79.51,18.05 v79.5,18.03 | IC5.4 82.95,13.83 83.06,13.72 v83.06,13.08 83.44,13.08 83.82,12.7 | U6.4 83.55,11.03 83.82,11.3 83.82,12.7 | R18.2 83.82,12.59 83.82,12.7
  Bottom 0.254: v78.99,22.73 79.12,22.61 83.31,22.61 85.6,24.89 86.77,26.06 J2.5 | v83.06,13.08 83.06,15.88 80.9,18.03 v79.5,18.03
BPIO5  (via drill 0.41)
  Top 0.254: RN2.6 95.02,17.38 88.67,23.73 J2.6 | U7.4 72.79,11.03 72.39,11.43 72.39,13.21 73.01,13.83 IC6.4 75.82,13.83 75.82,13.97 | U13.13 76.87,21.36 77.19,21.36 v77.38,21.55 | v82.17,21.93 82.11,21.88 IC11.5 | R20.2 75.82,13.97 | 75.82,13.97 75.82,14.61 v75.69,14.73
  Bottom 0.254: J2.6 86.67,23.73 84.88,21.93 v82.17,21.93 82.14,21.93 82.01,22.06 77.89,22.06 v77.38,21.55 75.18,19.35 75.18,15.24 v75.69,14.73
BPIO6  (via drill 0.41)
  Top 0.254: RN2.7 94.22,15.64 88.67,21.19 J2.7 | R22.2 84.96,2.4 U8.4 81.42,2.4 80.89,2.93 80.89,4.56 81.53,5.19 IC7.4 83.3,5.19 83.82,5.71 v83.82,9.78 | U13.12 78.47,20.71 v78.49,20.7 | IC11.2 80.16,19.53 v80.26,19.43
  Bottom 0.254: v83.82,9.78 85.47,11.43 85.47,16.64 86.23,17.4 87.32,17.4 88.12,18.2 88.12,19.87 86.8,21.19 J2.7 80.26,21.19 | 80.26,21.19 78.97,21.19 v78.49,20.7 | v80.26,19.43 80.26,21.19
BPIO7  (via drill 0.41)
  Top 0.254: RN2.8 93.32,13.36 88.03,18.65 J2.8 | IC11.4 81.46,20.12 82.55,19.03 v82.55,18.65 | U13.11 77.88,20.06 v78.36,19.59 v78.36,19.58 | IC8.4 70.72,5.19 70.36,4.83 70.36,2.79 70.75,2.4 U9.4 73.52,2.4 74.04,2.92 74.04,3.56 74.94,4.46 R24.2 75.19,4.58 75.18,4.59 v75.18,8.26
  Bottom 0.254: 83.82,18.65 84.33,18.65 J2.8 | v75.18,8.26 79.76,8.26 83.82,12.32 83.82,18.65 | 83.82,18.65 v82.55,18.65 80.05,18.65 79.12,19.58 v78.36,19.58
BUFDIR0
  Top 0.254: R5.2 81.65,44.94 80.9,44.2 | IC1.5 81.28,43.05 80.9,43.43 80.9,44.2 | 80.9,44.2 80.9,44.32 77.34,44.32 76.07,43.05 76.07,39.88 76.07,38.99 75.72,38.63 67.46,38.63 65.75,36.93 65.75,33.49 65.51,33.25 U16.107
BUFDIR1
  Top 0.254: IC2.5 72.01,43.05 71.75,43.31 71.75,44.36 | U16.113 60.84,37.22 67.98,44.36 71.75,44.36 | 71.75,44.36 71.75,45.21 R7.2
BUFDIR2
  Top 0.254: IC3.5 81.15,34.67 81.15,35.56 | 81.15,35.56 81.15,35.95 81.77,36.58 R9.2 | U16.99 65.7,29.25 66.35,29.9 75.49,29.9 76.2,30.61 76.2,35.05 77.09,35.94 81.15,35.94 81.15,35.56
BUFDIR3
  Top 0.254: IC4.5 71.75,34.67 71.75,35.97 | 71.75,35.97 68.1,35.97 67.07,34.95 67.07,32.98 65.84,31.75 U16.104 | 71.75,35.97 72.5,36.72 R11.2
BUFDIR4
  Top 0.254: U16.79 73.41,19.25 74.03,18.63 77.56,18.63 78.85,17.34 80.9,17.34 | IC5.5 81.19,14.48 80.9,14.77 80.9,16.38 80.9,17.27 80.9,17.34 | 80.9,17.34 81.58,17.34 R17.2
BUFDIR5
  Top 0.254: IC6.5 72.68,14.48 72.38,14.78 72.38,16.15 R19.2 72,16.53 72,17.02 71.17,17.85 66.39,17.85 65.79,17.25 U16.75
BUFDIR6
  Top 0.254: IC7.5 81.32,5.84 80.89,6.27 80.89,8.39 80.14,9.14 R21.2 79.39,10.02 79.35,10.05 65.02,10.05 63.4,11.68 59.69,11.68 58.84,12.53 U16.64
BUFDIR7
  Top 0.254: IC8.5 70.52,5.84 70.35,6.01 70.35,7.13 R23.2 69.74,7.87 68.88,8.73 64.26,8.73 62.77,10.22 59.24,10.22 57.34,12.13 U16.61
BUFIO0
  Top 0.254: IC1.3 77.39,42.4 76.61,41.63 76.61,38.83 75.89,38.1 67.62,38.1 66.16,36.63 66.16,33.24 65.67,32.75 U16.106
BUFIO1
  Top 0.254: IC2.3 67.38,42.4 61.34,36.36 U16.112
BUFIO2
  Top 0.254: IC3.3 77.58,34.02 76.8,33.24 76.8,30.51 75.79,29.49 66.77,29.49 66.03,28.75 U16.98
BUFIO3
  Top 0.254: IC4.3 68.37,34.02 68.1,33.75 67.85,33.5 67.61,33.25 67.61,32.94 65.42,30.75 U16.102
BUFIO4
  Top 0.254: U16.78 73.15,18.75 73.71,18.19 76.1,18.19 77.18,17.11 77.18,14.19 77.55,13.83 IC5.3
BUFIO5
  Top 0.254: IC6.3 68.59,13.83 65.67,16.75 U16.74
BUFIO6
  Top 0.254: IC7.3 77.76,5.19 76.7,6.25 76.7,8.52 75.67,9.55 64.77,9.55 63.2,11.12 59.64,11.12 58.34,12.43 U16.63
BUFIO7
  Top 0.254: U16.60 56.84,12.02 59.2,9.66 61.85,9.66 66.33,5.19 IC8.3
BUFOD0
  Top 0.254: U16.105 65.77,32.25 66.67,33.15 66.67,36.38 67.98,37.69 76.44,37.69 77.47,38.73 R1.1 77.6,39.86 77.99,40.26 U1.2
BUFOD1
  Top 0.254: U2.2 70.34,40.24 R2.1 66.34,40.24 62.34,36.24 U16.110
BUFOD2
  Top 0.254: U3.2 79.63,31.86 77.98,31.86 R3.1 77.72,30.73 76.08,29.08 67.18,29.08 66.35,28.25 U16.97
BUFOD3
  Top 0.254: U16.101 66.06,30.25 67.42,31.61 R4.1 68.72,31.88 U4.2
BUFOD4
  Top 0.254: U6.2 77.6,11.68 R13.1 77.45,11.67 76.65,12.47 76.65,16.94 75.88,17.71 73.44,17.71 72.9,18.26 66.11,18.26 65.6,17.75 U16.76
BUFOD5
  Top 0.254: U7.2 69.09,11.68 R14.1 68.59,11.41 67.94,12.06 67.94,13.84 65.54,16.25 U16.73
BUFOD6
  Top 0.254: U8.2 79.5,3.03 R15.1 76.83,3.03 76.07,3.79 76.07,8.38 75.31,9.14 64.52,9.14 62.99,10.67 59.44,10.67 57.84,12.27 U16.62
BUFOD7
  Top 0.254: U16.56 54.84,9.68 56.26,8.26 62.48,8.26 66.1,4.64 66.1,2.98 66.32,2.76 R16.1 67.28,2.76 67.56,3.05 U9.2
D+  (via drill 0.41)
  Top 0.254: CON1.DP1 6.71,25.25 6.48,25.02 6.48,24.51 6.74,24.25 CON1.DP2 10.03,24.25 v12.57,26.8 12.83,27.05 R42.2
  Bottom 0.254: R42.2 12.83,27.05 v12.57,26.8
D-
  Top 0.254: CON1.DN1 8.75,24.75 8.89,24.89 8.89,25.75 | R43.2 10.79,26.42 10.13,25.75 8.89,25.75 | CON1.DN2 8.89,25.75
DISPLAY_AUX1
  Top 0.254: U5.44 20.79,9.59 24.5,5.87 J3.P5
DISPLAY_AUX2
  Top 0.254: U5.45 21.29,10.21 25.75,5.75 J3.P4
DISPLAY_CS
  Top 0.254: U5.50 23.79,10.39 29.5,4.67 J3.P1
DISPLAY_D/P
  Top 0.254: U5.49 23.29,10.21 28.25,5.24 J3.P2
DISPLAY_PWM
  Top 0.254: U5.46 21.79,10.77 27,5.56 J3.P3
DISPLAY_SPI_CLOCK
  Top 0.254: U5.41 19.29,7.59 20.75,6.13 J3.P8
DISPLAY_SPI_MISO
  Top 0.254: U5.42 19.79,8.47 22,6.25 J3.P7
DISPLAY_SPI_MOSI
  Top 0.254: U5.43 20.29,8.84 23.25,5.87 J3.P6
FLASH_CS
  Top 0.254: U5.132 23.29,37.9 22.92,38.27 22.92,41.46 24.77,43.31 U12.1
FLASH_MISO
  Top 0.254: U5.134 22.29,37.26 21.59,37.96 21.59,41.61 23.5,43.52 U12.2
FLASH_MOSI
  Top 0.254: U5.135 21.79,36.93 20.95,37.76 U12.5
FLASH_SCK
  Top 0.254: U5.133 22.79,37.46 22.23,38.02 22.23,38.27 U12.6
FPGA_CDONE  (via drill 0.41)
  Top 0.254: U16.65 59.34,13.16 59.65,12.85 v59.67,12.85 | U5.69 33.28,15 33.81,15.52 35.31,15.52 36.35,14.47 36.7,14.47 v37.38,13.79 | R37.1 50.8,11.3 51.44,11.94 v51.82,11.94
  Bottom 0.254: v59.67,12.85 58.75,11.94 v51.82,11.94 43.43,11.94 42.61,12.76 38.42,12.76 v37.39,13.79 v37.38,13.79
FPGA_CRESET  (via drill 0.41)
  Top 0.254: U16.66 59.84,13.69 v60.71,12.83 | U5.70 33.78,14.86 34.04,15.11 35.01,15.11 v36.37,13.76 | R38.1 52.16,11.01 v52.45,11.3 | v36.37,13.76
  Bottom 0.254: v36.37,13.76 36.37,13.73 37.88,12.22 42.39,12.22 43.18,11.43 51.31,11.43 51.44,11.3 v52.45,11.3 52.58,11.43 59.34,11.43 60.71,12.79 v60.71,12.83
FPGA_PROG_CLOCK  (via drill 0.41)
  Top 0.254: U16.70 61.84,15.22 58.5,18.57 47.75,18.57 47.39,18.21 v47.32,18.21 | U5.74 36.28,16.75 35.46,17.57 v35.46,17.83
  Bottom 0.254: v47.32,18.21 35.84,18.21 v35.46,17.83
FPGA_PROG_CS  (via drill 0.41)
  Top 0.254: U16.71 62.34,15.24 | 62.34,15.24 62.34,15.3 58.66,18.97 47.62,18.97 v46.87,18.97 | U5.73 35.99,16.25 35.13,17.1 v34.88,17.1 | 62.34,15.24 64.77,15.24 65.91,14.1 R29.2
  Bottom 0.254: v46.87,18.97 46.64,18.74 35.48,18.74 34.82,18.09 34.82,17.16 v34.88,17.1
FPGA_PROG_MISO  (via drill 0.41)
  Top 0.254: U5.75 37.41,17.25 38.2,16.46 v40.06,16.46 | U16.67 60.34,15.28 57.89,17.73 49.23,17.73 v48.97,17.47
  Bottom 0.254: v48.97,17.47 48.45,16.95 41.52,16.95 41.02,16.46 v40.06,16.46
FPGA_PROG_MOSI  (via drill 0.41)
  Top 0.254: v40.77,17.11 38.14,17.11 37.51,17.75 U5.76 | U16.68 60.84,15.36 58.06,18.13 48.41,18.13 v48.16,17.88
  Bottom 0.254: v48.16,17.88 47.78,17.5 41.15,17.5 v40.77,17.11
FSMC_A0  (via drill 0.41)
  Top 0.254: U16.3 39.53,32.75 v39.32,32.53 | U5.10 33.19,29.25 34.54,30.6 v35.43,30.6
  Bottom 0.254: v35.43,30.6 36.88,30.6 38.81,32.53 v39.32,32.53
FSMC_A1  (via drill 0.41)
  Top 0.254: v34.82,29.97 34.59,29.97 33.37,28.75 U5.11 | U16.4 40.02,32.25 v39.37,31.59
  Bottom 0.254: v34.82,29.97 36.96,29.97 38.58,31.59 v39.37,31.59
FSMC_A2  (via drill 0.41)
  Top 0.254: v35.46,29.33 34.54,29.33 33.46,28.25 U5.12 | U16.7 44.7,30.75 44.76,30.81 v45.7,30.81
  Bottom 0.254: v35.46,29.33 36.91,29.33 38.51,30.94 45.57,30.94 v45.7,30.81
FSMC_A3  (via drill 0.41)
  Top 0.254: U5.13 33.75,27.75 34.7,28.7 v34.82,28.7 | U16.8 44.98,30.25 v45.06,30.18
  Bottom 0.254: v34.82,28.7 36.85,28.7 38.69,30.53 44.7,30.53 v45.06,30.18
FSMC_A4  (via drill 0.41)
  Top 0.254: U5.14 33.82,27.25 34.63,28.06 v35.45,28.06 v35.46,28.06 | v41.71,29.9 41.85,29.75 U16.9
  Bottom 0.254: v41.71,29.9 38.66,29.9 36.83,28.06 v35.46,28.06
FSMC_A5  (via drill 0.41)
  Top 0.254: v34.87,27.4 34.22,26.75 U5.15 | v42.14,29.11 42.28,29.25 U16.10
  Bottom 0.254: v34.87,27.4 36.75,27.4 38.46,29.11 v42.14,29.11
FSMC_D0
  Top 0.254: U5.85 U16.24
FSMC_D1
  Top 0.254: U5.86 U16.23
FSMC_D2  (via drill 0.41)
  Top 0.254: U16.1 40.93,33.75 v40.77,33.91 | v33.41,34.26 33.03,34.26 32.28,35 U5.114
  Bottom 0.254: v33.41,34.26 40.42,34.26 v40.77,33.91
FSMC_D3  (via drill 0.41)
  Top 0.254: U16.2 40.14,33.25 v40.01,33.38 | U5.115 31.79,34.64 v32.89,33.53
  Bottom 0.254: v32.89,33.53 33.78,33.53 34.04,33.78 39.61,33.78 v40.01,33.38
FSMC_D4  (via drill 0.41)
  Top 0.254: U5.58 27.79,20.53 v32.51,25.25 | v45.72,26.8 45.67,26.75 U16.15
  Bottom 0.254: v45.72,26.8 39.47,26.8 38.2,25.52 32.78,25.52 v32.51,25.25
FSMC_D5  (via drill 0.41)
  Top 0.254: U5.59 28.29,19.87 v33.29,24.87 | v46.35,26.04 46.24,26.15 45.47,26.15 45.37,26.25 U16.16
  Bottom 0.254: v46.35,26.04 39.43,26.04 38.42,25.02 33.44,25.02 v33.29,24.87
FSMC_D6  (via drill 0.41)
  Top 0.254: U5.60 28.79,19.43 33.68,24.33 v33.98,24.33 | U16.17 45.37,25.75 v45.72,25.4
  Bottom 0.254: v33.98,24.33 34.06,24.41 38.47,24.41 39.46,25.4 v45.72,25.4
FSMC_D7  (via drill 0.41)
  Top 0.254: U5.63 30.29,20.17 33.66,23.54 v34.34,23.54 | U16.18 44.6,25.25 v45.09,24.77
  Bottom 0.254: v34.34,23.54 34.37,23.57 38.26,23.57 39.46,24.77 v45.09,24.77
FSMC_D8  (via drill 0.41)
  Top 0.254: v44.45,24.13 44.07,24.51 44.07,24.52 43.83,24.75 U16.19 | U5.64 30.79,19.99 33.68,22.88 v34.92,22.88
  Bottom 0.254: v44.45,24.13 39.45,24.13 38.35,23.04 35.08,23.04 v34.92,22.88
FSMC_D9  (via drill 0.41)
  Top 0.254: v44.95,22.38 44.32,21.75 U16.25 | U5.65 31.29,18.85 v33.51,21.07
  Bottom 0.254: v44.95,22.38 43.52,20.95 34.65,20.95 34.45,21.15 33.58,21.15 v33.51,21.07
FSMC_D10  (via drill 0.41)
  Top 0.254: v45.51,21.57 45.44,21.57 45.12,21.25 U16.26 | U5.66 31.79,18.11 v34.19,20.52
  Bottom 0.254: v34.19,20.52 44.45,20.52 v45.51,21.57
FSMC_D11  (via drill 0.41)
  Top 0.254: v44.91,20 44.66,20.25 U16.28 | U5.67 32.28,17.7 v34.24,19.65
  Bottom 0.254: v34.24,19.65 34.41,19.82 44.74,19.82 v44.91,20
FSMC_D12  (via drill 0.41)
  Top 0.254: U16.29 44.13,19.75 44.52,19.36 45.26,19.36 v45.85,19.94 | U5.68 32.78,17.62 34.12,18.96 34.76,18.96 v34.98,19.17
  Bottom 0.254: v34.98,19.17 35.11,19.31 45.21,19.31 v45.85,19.94
FSMC_D13
  Top 0.254: U5.77 37.59,18.25 38.09,17.75 U16.33
FSMC_D14
  Top 0.254: U5.78 37.67,18.75 38.17,18.25 U16.32
FSMC_D15
  Top 0.254: U16.31 38.3,18.75 37.8,19.25 U5.79
FSMC_NE3_CE  (via drill 0.41)
  Top 0.254: v46.99,34.29 47.17,34.11 47.17,25.29 45.13,23.25 U16.22 | U5.125 26.79,35.19 v27.69,34.29
  Bottom 0.254: v27.69,34.29 v27.69,34.3 29.27,35.88 41.99,35.88 43.58,34.29 v46.99,34.29
FSMC_NOE_OE  (via drill 0.41)
  Top 0.254: U16.11 45.73,28.75 46.35,29.38 46.35,32.38 v45.72,33.02 | U5.118 30.29,34.48 v30.48,34.29
  Bottom 0.254: v30.48,34.29 31.11,34.92 40.87,34.92 42.77,33.02 v45.72,33.02
FSMC_NWE_WE  (via drill 0.41)
  Top 0.254: U16.12 45.8,28.25 46.76,29.21 46.76,33.02 46.76,33.25 v46.35,33.66 | U5.119 29.79,34.87 v29.21,34.29
  Bottom 0.254: v29.21,34.29 30.35,35.43 41.4,35.43 43.18,33.66 v46.35,33.66
GND  (via drill 0.41, 0.51)
  Top 0.254: CON1.P$5 6.84,29.26 v9.14,29.26
  Top 0.406: CON1.P$5 7.7,29.32 CON1.GND@1 | CON1.P$6 2.6,30.99 v2.54,30.99 | CON1.P$7 2.6,18.86 v2.56,18.86 | CON1.GND@2 7.7,20.68 CON1.P$8 9.14,20.68 v9.14,20.62 | IC12.2 v8.64,11.81
  Bottom 0.254: CON1.P$6 2.6,30.93 v2.54,30.99 | CON1.P$7 2.6,18.9 v2.56,18.86 | CON1.P$8 8.23,20.68 8.38,20.83 8.94,20.83 v9.14,20.62 | CON1.P$5 6.84,29.26 v9.14,29.26
  other vias: 99.11,41.18 99.11,25 1.24,41.81 1.24,8.82 44.48,32.08 44.45,27.48 42.24,27.48 38.81,28.42 41.15,9.53 39.24,13.72 34.29,6.1 25.02,36.83 35.56,33.02 16.89,36.83 22.91,30.35 22.86,25.04 31.27,25.15 32.84,30.35 39.73,23.42 39.5,21.59 35.28,21.84 34.01,17.78 19.46,16.48 17.27,18.9 16.31,13.56 23.8,16.48 49.02,15.49 50.42,29.08 50.55,22.1 46.35,4.19 48.77,8.26 14.1,26.21 8.49,1.08 91.67,1.08 98.66,8.06 91.67,48.7 50.02,48.83 8.23,48.79 18.9,45.74 29.97,40.13 25.65,39.75 32.77,40.13 41.66,45.72 49.78,39.12 54.99,42.55 61.72,13.08 55.75,15.75 35.81,40.13 37.82,26.47 51.08,33.86 37.85,33.15 47.9,33.6 38.73,40.13 29.72,36.83 54.76,32.84 26.67,34.29 26.29,45.85 51.56,44.45 60.07,36.83 55.63,29.97 58.8,20.83 58.55,15.75 19.81,19.46 41.15,6.6 17.17,4.04 70.61,8.38 77.09,9.27 80.39,10.16 64.64,11.56 67.44,11.3 75.06,1.52 79.5,1.52 84.07,3.94 88.39,5.84 86.23,8.38 90.04,11.68 64.9,7.87 61.47,9.02 57.28,9.4 53.59,9.02 72.64,17.53 68.07,15.49 78.61,18.54 66.67,20.07 70.87,25.53 74.93,26.54 88.27,17.27 85.47,17.65 85.72,19.94 63.12,18.16 46.86,8.26 45.34,10.16 15.14,4.8 18.19,0.99 6.25,7.09 1.17,12.67 8.92,18.52 14,20.55 4.95,35.35 20.45,37.08 43.81,35.56 31.62,33.53 67.18,39.24 67.82,43.18 75.18,36.96 79.5,38.73 71.63,36.83 75.18,33.66 68.45,30.61 67.82,34.42 80.9,36.83 85.34,33.53 84.07,36.83 79.76,29.34 87.88,32.77 88.39,28.7 77.22,34.54 75.18,42.04 76.96,42.93 76.58,44.83 80.77,45.09 83.06,48.51 84.33,42.04 77.85,14.48 77.72,17.53 74.42,19.3 72.39,20.32 76.83,10.79 80.9,13.08 52.22,41.48 48.54,30.56 52.58,26.42
  pour Top (isolate 0.203, rank 2): 0,50 100,50 100,0 0,0
  pour Bottom (isolate 0.203, rank 2): 0,50 100.12,50 arc-3 100.12,0 0,0
LAT0
  Top 0.254: U16.91 68.41,25.25 U13.2
LAT1
  Top 0.254: U16.90 67.14,24.75 67.28,24.61 U13.3
LAT2
  Top 0.254: U16.88 66.94,23.75 67.15,23.96 U13.4
LAT3
  Top 0.254: U16.87 67.22,23.25 67.28,23.31 U13.5
LAT4
  Top 0.254: U16.85 66.86,22.25 67.28,22.66 U13.6
LAT5
  Top 0.254: U16.84 67.14,21.75 67.4,22.01 U13.7
LAT6
  Top 0.254: U16.83 67.29,21.25 67.4,21.36 U13.8
LAT7
  Top 0.254: U16.82 68.38,20.75 U13.9
LD1  (via drill 0.41)
  Top 0.254: R47.2 54.92,47.03 v53.85,47.03 | U5.110 34.28,36.37 34.51,36.59 34.51,45.37 34.29,45.59 v34.29,45.64
  Bottom 0.254: v53.85,47.03 49.74,47.03 48.9,47.88 35.53,47.88 34.29,46.63 v34.29,45.64
MCU_ADC5
  Top 0.254: R40.2 12.46,14.25 U5.37
  Top 0.305: R39.2 R40.2
MCU_ADC6  (via drill 0.41)
  Top 0.254: U5.36 18.55,16.25 19.23,15.57 v23.62,15.57 | RN3.7 RN3.8 44.2,8.87 v44.2,9.91
  Bottom 0.254: v44.2,9.91 43.69,10.41 42.67,10.41 41.99,11.09 37,11.09 36.44,11.66 27.53,11.66 v23.62,15.57
MCU_AUX1  (via drill 0.41)
  Top 0.254: U16.137 48.84,34.74 v48.51,34.42 | U5.111 33.78,36.8 v33.76,36.83
  Bottom 0.254: v48.51,34.42 46,36.93 33.86,36.93 v33.76,36.83
MCU_AUX2  (via drill 0.41)
  Top 0.254: U16.136 49.34,34.51 v49.43,34.42 | U5.112 33.28,36.39 33.1,36.58 v33.1,37.39
  Bottom 0.254: v49.43,34.42 46.33,37.52 33.22,37.52 v33.1,37.39
MCU_AUX3  (via drill 0.41)
  Top 0.254: U16.135 49.84,35 v50.29,34.54 | U5.113 32.78,36.28 32.26,36.8 v32.26,36.88
  Bottom 0.254: v50.29,34.54 46.76,38.08 32.74,38.08 32.26,37.59 v32.26,36.88
MCU_AUX4  (via drill 0.41)
  Top 0.254: v49.28,36.71 49.88,36.71 50.34,36.24 U16.134 | U5.122 28.29,36.61 v28.07,36.83
  Bottom 0.254: v49.28,36.71 47.48,38.5 29.74,38.5 v28.07,36.83
MCU_AUX5  (via drill 0.41)
  Top 0.254: U5.139 19.79,38.19 v19.95,38.35 | v51.18,41.53 51.64,41.07 51.64,37.15 52.34,36.45 U16.130
  Bottom 0.254: v51.18,41.53 51.17,41.53 50.53,42.16 21.97,42.16 20.33,40.52 20.33,38.73 v19.95,38.35
MCU_AUX6  (via drill 0.41)
  Top 0.254: U5.140 19.29,38.96 v19.44,39.12 | U16.125 54.84,37.72 53.71,38.85 53.71,41.26 v52.7,42.27
  Bottom 0.254: v52.7,42.27 52.4,42.57 21.49,42.57 19.82,40.9 19.82,39.5 v19.44,39.12
MCU_AUX7  (via drill 0.41)
  Top 0.254: U16.124 55.34,37.97 54.23,39.08 54.23,41.91 v53.72,42.42 | v18.93,39.88 18.79,39.73 U5.141
  Bottom 0.254: v53.72,42.42 53.11,43.03 20.99,43.03 18.93,40.97 v18.93,39.88
MCU_AUX8  (via drill 0.41)
  Top 0.254: U5.142 18.29,36.66 18.07,36.88 v18.07,37.59 | U16.122 56.34,42.41 55.32,43.43 v55.24,43.43
  Bottom 0.254: v18.07,37.59 18.07,38.35 18.07,40.93 20.57,43.43 v55.24,43.43
MCU_AUX9  (via drill 0.41)
  Top 0.254: U16.37 45.34,14.61 v44.58,14.61 | U5.53 25.29,17.4 25.4,17.52 25.4,18.41 v24.77,19.05
  Bottom 0.254: v24.77,19.05 30.23,19.05 31.11,18.16 31.11,15.88 32,14.99 32.51,14.48 44.32,14.48 44.45,14.61 v44.58,14.61
MCU_AUX10  (via drill 0.41)
  Top 0.254: U16.38 45.84,14.99 45.59,15.24 v45.16,15.24 | U5.57 27.29,19.7 v26.92,20.07
  Bottom 0.254: v45.16,15.24 44.31,15.24 43.98,14.9 32.72,14.9 31.72,15.9 31.72,18.26 30.29,19.68 27.3,19.68 v26.92,20.07
MCU_AUX11  (via drill 0.41)
  Top 0.254: U16.39 46.34,15.29 v45.75,15.88 | U5.54 25.79,17.33 25.81,17.35 25.81,19.79 v24.51,21.08
  Bottom 0.254: v45.75,15.88 44.37,15.88 43.81,15.31 33.08,15.31 32.33,16.06 32.33,18.36 30.59,20.09 28.04,20.09 27.05,21.08 v24.51,21.08
MCU_AUX12  (via drill 0.41)
  Top 0.254: U16.41 47.34,15.4 v46.74,16 | v26.54,22.1 26.29,21.84 26.29,19.7 U5.55
  Bottom 0.254: v46.74,16 46.74,16.04 46.27,16.51 44.32,16.51 43.56,15.75 33.4,15.75 32.86,16.29 32.86,18.52 30.88,20.5 28.78,20.5 27.18,22.1 v26.54,22.1
MCU_INT0  (via drill 0.41, 0.51)
  Top 0.254: U5.1 24.23,33.75 v24.77,34.29 | U16.129 52.84,36.77 52.83,36.77 v52.83,36.93
  Bottom 0.254: v52.83,36.93 50.8,36.93 48.39,39.34 28.67,39.34 24.77,35.43 v24.77,34.29
MCU_INT1  (via drill 0.41)
  Top 0.254: U5.2 25,33.25 v25.65,33.91 | U16.49 51.34,16.54 v51.44,16.64
  Bottom 0.254: v25.65,33.91 25.65,35.75 28.82,38.91 48.13,38.91 53.85,33.2 53.85,30.35 51.44,27.94 v51.44,16.64
MCU_MCO  (via drill 0.41)
  Top 0.254: U5.100 38.49,29.75 40.15,28.09 41.26,28.09 v41.27,28.07 | v52.47,32.38 53.34,33.25 U16.128
  Bottom 0.254: v52.47,32.38 52.45,32.38 48.18,28.12 41.33,28.12 v41.27,28.07
MCU_VPU  (via drill 0.35, 0.41)
  Top 0.254: U11.5 U11.6 90.2,4.56 90.7,5.06 v90.83,5.06 | U11.13 U11.12 88.25,7.73 89.03,6.95 v89.03,6.48 | U10.5 U10.6 90.2,42.52 v90.17,42.54 | U10.12 U10.13 87.6,45.24 v87.63,45.21 | U5.56 26.79,13.6 v27.43,12.95 | v61.21,7.11 63.4,4.93 v63.5,4.93
  Top 0.305: U10.6 90.2,40.1 v91.06,39.24 | U11.13 87.6,7.9 v87.63,7.87
  Bottom 0.254: v89.03,6.48 90.44,5.06 v90.83,5.06 | v90.17,42.54 87.63,45.09 v87.63,45.21 | v27.43,12.95 28.09,12.29 36.82,12.29 37.51,11.6 42.25,11.6 42.93,10.92 51.05,10.92 51.31,10.67 57.4,10.67 60.96,7.11 v61.21,7.11 | v63.5,4.93 67.7,4.93 67.82,5.05 82.55,5.05 82.67,4.93 83.67,4.93 86.61,7.87 v87.63,7.87
  Bottom 0.305: v91.06,39.24 91.06,11.3 v87.63,7.87
N$1  (via drill 0.41)
  other vias: 9.14,27.43 9.14,22.61
  pour Top (no thermals): 3.81,22.1 3.81,27.94 5.59,27.94 9.53,27.94 9.53,26.92 5.59,26.92 5.59,23.11 9.53,23.11 9.53,22.1 5.59,22.1 5.59,17.53 3.81,17.53
  pour Bottom (no thermals): 8.64,22.1 8.64,27.94 9.53,27.94 9.53,22.1
N$2
  Top 0.254: U10.1 86.95,41.87 88.8,43.71 92.76,43.71 94.22,42.26 RN1.7
N$3
  Top 0.254: U10.4 88.9,42.16 89.92,43.18 92.39,43.18 93.32,42.25 RN1.8
N$4  (via drill 0.41)
  Top 0.254: v97.16,41.91 95.95,41.91 RN1.5 | v91.69,46.35 91.33,46.72 U10.8
  Bottom 0.254: v91.69,46.35 91.69,45.09 94.87,41.91 v97.16,41.91
N$5
  Top 0.254: RN1.6 95.02,42.26 92.46,44.82 92.46,46.86 91.31,48.01 89.15,48.01 88.9,47.75 U10.11
N$6  (via drill 0.41)
  Top 0.305: R47.1 v57.81,47 LED4.A
  Bottom 0.305: v57.81,47 LED4.A
N$7  (via drill 0.41)
  Top 0.305: R46.1 v22.7,47 LED1.A
  Bottom 0.305: LED1.A v22.7,47
N$8  (via drill 0.41)
  Top 0.254: U5.23 14.33,22.75 13.72,23.37 12.62,23.37 XTAL1.2 12.11,23.88 v10.67,23.88
  Bottom 0.254: C20.2 v10.67,23.88
N$9  (via drill 0.41)
  Top 0.254: U5.24 14.38,22.25 12.19,20.07 XTAL1.1 11.86,19.05 v10.67,19.05
  Bottom 0.254: C18.2 11.8,19.05 v10.67,19.05
N$11
  Top 0.254: R35.2 36.56,2.83 Q1.6 37.1,2.81 37.79,3.5 37.79,5.4 37.8,5.4 Q2.1
N$12
  Top 0.254: IC12.4 11.78,10.86 R31.1 11.81,8.89 R32.1 R30.2
N$13  (via drill 0.41)
  Top 0.305: LED8.A v42.51,47 R49.1
  Bottom 0.305: v42.51,47 LED8.A
N$14  (via drill 0.41)
  Top 0.254: CON1.CC1 6.26,26.25 v6.22,26.29 | v5.33,31.24 5.33,31.92 R44.1
  Bottom 0.254: v6.22,26.29 5.33,27.18 v5.33,31.24
N$15  (via drill 0.41)
  Top 0.254: U14.4 9.71,5.15 v9.4,5.46 | v3.56,8.89 R28.1
  Bottom 0.254: v9.4,5.46 5.97,8.89 v3.56,8.89
N$18  (via drill 0.41)
  Top 0.305: R48.1 v77.62,47 LED6.A
  Bottom 0.305: LED6.A v77.62,47
N$20  (via drill 0.41)
  Top 0.254: CON1.CC2 6.59,23.25 v6.22,23.62 | v4.06,31.24 4.06,32.17 R45.1
  Bottom 0.254: v6.22,23.62 4.06,25.78 v4.06,31.24
N$21
  Top 0.305: R36.2 43.35,5.31 RN3.4
N$25
  Top 0.254: R28.2 R30.1 8.17,7.05 U14.1
N$26  (via drill 0.41)
  Bottom 1.219: v14.73,12.45 14.73,9.37 36.09,9.37 v36.07,9.4 v36.07,8.38
  other vias: 14.73,11.3
  pour Top (no thermals): 15.37,13.46 9.14,13.46 9.14,11.94 14.22,11.94 14.22,10.67 14.99,10.67 15.37,10.67 15.37,11.94
  pour Top (no thermals): 36.96,9.78 35.31,9.78 35.31,3.81 36.96,3.81
N$27
  Top 0.254: Q1.1 Q1.2 Q1.3 40.26,4.31 R34.2
N$31
  Top 0.254: U14.3 8.15,5.15 C24.1 R26.2
N$32
  Top 0.254: U15.3 53.91,2.81 D1.A 57.25,2.81 R33.2
N$33
  Top 0.254: U11.1 86.95,4.4 87.76,5.21 88.77,5.21 90.04,6.48 93.97,6.48 95.02,7.53 RN2.3
N$42  (via drill 0.41)
  Top 0.254: RN2.4 96.86,7.92 v97.16,7.62 | v92.71,5.84 90.2,5.84 88.9,4.54 U11.4
  Bottom 0.254: v97.16,7.62 94.49,7.62 v92.71,5.84
N$44
  Top 0.254: U11.8 92.24,9.25 93.32,8.17 RN2.1
N$45
  Top 0.254: U11.11 88.9,8.26 90.09,7.06 93.75,7.06 94.22,7.53 RN2.2
N$61  (via drill 0.41)
  Top 0.254: R33.1 60.49,7.75 61.85,7.75 v62.48,7.11 | IC11.3 80.81,19.87 v81.27,19.42 | v84.58,19.3 v84.58,18.02
  Bottom 0.254: v81.27,19.42 84.47,19.42 v84.58,19.3 | v84.58,18.02 84.58,11.68 80.74,7.85 80.74,7.24 80.36,6.86 62.74,6.86 v62.48,7.11
N$64
  Top 0.254: U15.4 53.91,5.37 52.01,3.46 U15.1 45.33,3.15 R36.1
PWM
  Top 0.254: U5.96 39.11,27.75 39.77,27.09 39.77,24.68 40.7,23.75 U16.21
RST  (via drill 0.41)
  Top 0.254: U5.25 16.35,21.75 v16.51,21.59
  Bottom 0.254: R25.1 v16.51,21.59
SRAM0_CLOCK
  Top 0.254: 46.84,37.52 46.89,37.56 | 46.89,37.56 47.05,37.72 47.05,41.29 47.62,41.87 IC9.6 | U16.141 46.84,37.52 | 46.84,37.52 46.89,37.56
SRAM0_CS
  Top 0.254: U16.144 45.34,37.48 45.11,37.71 45.11,39.28 | 45.11,39.28 IC9.1 45.11,39.28
SRAM0_SIO0
  Top 0.254: U16.138 48.34,37.9 48.32,37.92 48.32,41.16 48.66,41.51 48.9,41.74 IC9.5
SRAM0_SIO1
  Top 0.254: U16.142 46.34,38.73 | 46.34,38.73 46.34,39.29 | IC9.2 46.34,39.29 | 46.34,39.29 46.34,38.73
SRAM0_SIO2
  Top 0.254: U16.139 47.84,37.39 47.69,37.53 47.62,37.6 IC9.3
SRAM0_SIO3
  Top 0.254: U16.143 45.84,37.83 45.78,37.89 45.78,41.34 46.35,41.91 IC9.7
SRAM1_CLOCK
  Top 0.254: U16.118 58.34,37.55 58.98,38.2 58.98,41.64 59.63,42.29 59.63,44.57 IC10.6
SRAM1_CS
  Top 0.254: U16.121 56.84,38.42 57.02,38.61 IC10.1
SRAM1_SIO0
  Top 0.254: U16.116 59.34,37.13 60.25,38.05 60.25,41.53 61.02,42.29 61.02,44.45 IC10.5
SRAM1_SIO1
  Top 0.254: U16.119 57.84,37.76 58.29,38.21 IC10.2
SRAM1_SIO2
  Top 0.254: IC10.3 59.56,38.11 58.84,37.39 U16.117
SRAM1_SIO3
  Top 0.254: U16.120 57.34,37.96 57.7,38.31 57.7,41.75 58.36,42.42 58.36,44.57 IC10.7
SWCLK
  Top 0.254: J1.4 35.56,45.09 34.91,44.44 34.91,36.26 34.78,36.13 U5.109
SWDIO
  Top 0.254: J1.3 34.12,47.45 36.27,47.45 36.66,47.06 36.66,40.18 37.13,39.71 37.13,36.75 38.71,35.16 38.71,33.11 37.85,32.25 U5.105
USB_D+  (via drill 0.41)
  Top 0.254: v18.46,31.97 18.68,31.75 34.7,31.75 U5.104 | R42.1 12.83,30.87 13.88,31.93 v13.97,31.93
  Bottom 0.254: v13.97,31.93 14.02,31.98 16.51,31.98 v18.46,31.98 v18.46,31.97
USB_D-  (via drill 0.41)
  Top 0.254: v17.78,31.29 17.82,31.25 34.78,31.25 U5.103 | v11.94,31.16 11.94,30.62 R43.1
  Bottom 0.254: v11.94,31.16 17.65,31.16 v17.78,31.29
USB_DET  (via drill 0.41)
  Top 0.254: v14.1,29.46 14.1,31.06 14.79,31.75 U5.5
  Bottom 0.254: v14.1,29.46 R41.2
USBLED
  Top 0.254: R49.2 45.35,47.74 45.16,47.94 32.7,47.94 31.75,46.99 31.75,45.41 30.79,44.45 U5.117
VREF/VOUT  (via drill 0.35, 0.41)
  Top 0.254: Q2.2 37.85,7.93 37.25,7.33 37.25,4 36.81,3.56 Q1.5 | U11.3 U11.2 | U11.9 U11.10 | U10.9 U10.10 89.55,45.73 v87.61,43.79 | U10.2 U10.3 88.25,39.64 v88.27,39.62 | C15.2 82.95,6.49 IC7.6 | C16.2 72.79,6.49 IC8.6 | 81.9,15.13 IC5.6 | IC2.6 74.68,43.7 C6.2 v75.18,45.87 | IC1.6 83.82,43.7 C5.2 v84.33,45.87 | IC4.6 74.68,35.32 C8.2 | IC3.6 84.07,35.32 C7.2 | IC6.6 74.56,15.13 75.07,15.64 C14.2 v75.95,16.51
  Top 0.305: C13.2 v81.9,15.75 81.9,15.13 | IC5.6 85.79,15.13 J2.9 | v88.27,2.29 88.25,2.3 U11.3 | U11.9 90.2,8.24 90.69,7.75 v91.69,7.75 | C8.2 75.96,35.83 77.98,37.85 v84.45,37.85 84.84,37.47 84.84,36.08 C7.2 | v87.88,11.43 88.9,11.43 89.55,10.78 U11.10 | C15.2 82.95,8.88 v82.93,8.89 | IC8.6 72.96,6.49 v73.48,5.97
  Bottom 0.305: v87.88,11.43 87.82,11.49 | v91.69,7.75 91.69,3.56 90.42,2.29 v88.27,2.29 | v81.9,15.75 81.01,16.64 76.07,16.64 v75.95,16.51 | v82.93,8.89 82.99,8.83 85.15,8.83
  Bottom 0.406: 89.66,41.74 89.58,41.82 | 89.58,41.82 v87.61,43.79 85.53,45.87 v84.33,45.87 v75.18,45.87 | 89.58,41.82 89.66,41.74 | 89.66,41.74 89.66,39.62 v88.27,39.62 86.49,37.85 v84.45,37.85
  Bottom 0.813: 89.66,16.13 89.66,39.62
  Bottom 1.067: v40.01,8.13 44.83,8.13 46.99,5.97 v73.48,5.97 82.3,5.97 85.15,8.83 87.82,11.49 89.66,13.34 89.66,16.13 86.79,16.13
  Bottom 1.219: 86.79,16.13 J2.9
  other vias: 41.15,8.13
  pour Top (no thermals): 43.05,8.64 37.59,8.64 37.59,7.37 43.05,7.37
VREG_DAC
  Top 0.254: U5.40 18.79,6.85 15.24,3.3 R26.1
VREGEN  (via drill 0.41)
  Top 0.254: 13.92,32.56 13.46,33.02 13.46,43.18 19.05,48.77 49.11,48.77 49.73,48.15 50.3,48.15 50.92,48.77 63.5,48.77 65.27,47 R48.2 | 13.92,32.56 14.23,32.56 14.54,32.25 U5.4 | 13.92,32.56 12.44,32.56 10.1,30.23 5.59,30.23 3.05,27.69 v3.05,22.61 | v8.64,10.79 7.4,10.79 IC12.3
  Top 0.305: R27.1 4.97,10.86 IC12.3
  Bottom 0.254: v8.64,10.79 9.27,10.79 10.16,11.68 10.16,15.11 3.05,22.23 v3.05,22.61
VUSB  (via drill 0.41, 0.51)
  Top 0.305: D1.C v55.88,4.06 | U11.14 86.95,7.24 v87,7.24 85.22,7.24 C41.1 | U10.14 86.13,46.72 v86.11,46.74 85.85,46.99 C40.1 | IC11.16 78.96,26.2 v78.87,26.29 78.74,26.42 C27.1 | v92.08,27.43 v92.07,27.43 86.56,27.43 84.78,29.21 v82.55,29.21 | C37.1 C38.1 50.8,5.8 | C64.+ 8.49,16.6 R39.1 | U14.5 11.68,7.05 | 11.68,7.05 12.6,7.05 C26.1 | 11.68,7.05 v11.68,5.97 | 50.8,5.8 52.01,5.8 U15.5 | v50.8,4.06 50.8,5.8
  Bottom 0.305: 55.88,2.54 v55.88,4.06 | 50.8,2.54 v50.8,4.06 | v78.87,26.29 81.79,29.21 v82.55,29.21 | 87.69,6.54 v87,7.24
  Bottom 0.813: 38.1,2.54 50.8,2.54 55.88,2.54 87.38,2.54 87.38,6.22 87.69,6.54 92.08,10.92 v92.08,27.43 92.08,42.7 88.03,46.74 v86.11,46.74
  Bottom 1.219: v39.37,44.5 18.54,44.5 12.24,44.5 0.89,33.15 0.89,14.22 v4.57,14.22 v6.1,14.22 6.1,11.56 v11.68,5.97 15.11,2.54 38.1,2.54 v38.1,9.53 v39.12,9.53
  other vias: 38.1,44.5
  pour Top: 6.1,16.26 2.54,16.26 2.54,13.72 4.32,13.72 4.32,11.94 7.87,11.94 7.87,13.72 7.87,16.26
  pour Top (no thermals): 37.47,45.13 40.01,45.13 40.01,41.45 37.47,41.45
  pour Top (no thermals): 40.01,12.88 37.72,12.88 37.72,9.06 40.01,9.06

## Text on the board
tPlace: PWR | USB | MODE | VREG | AUG 2019 | Ian Lesnet | I+S 2019 | SMDPRUTSER | v.trocio | Bus Pirate Ultra v1.0b
bPlace: PWR | USB | MODE | VREG | AUG 2019 | GND | +5V | 3V3 | VPU | ADC/DAC | Bus Pirate Ultra v1.0b | http://dangerousprototypes.com | https://smdprutser.nl | AUX | CS | MISO | CLK | MOSI | Fulfillment by | Seeed Studio | www.seeedstudio.com
tNames: 3.3V | GND | SW- / DIO | SW- / CLK
tValues: vimark
Reference: GND | +5v | +3v3 | Vpu | USB | ADC/DAC | I/O header | AUX0 | CS | MISO | CLK | MOSI | BUS PIRATE Ultra | Ian Lesnet MAY 2019 | http://dangerousprototypes.com | CC-0